# Altium schematic sheet Sheet1.SchDoc: LED_MATRIX
size A4; DocumentNumber: 1; Revision: 1.0; SheetNumber: 1; SheetTotal: 1
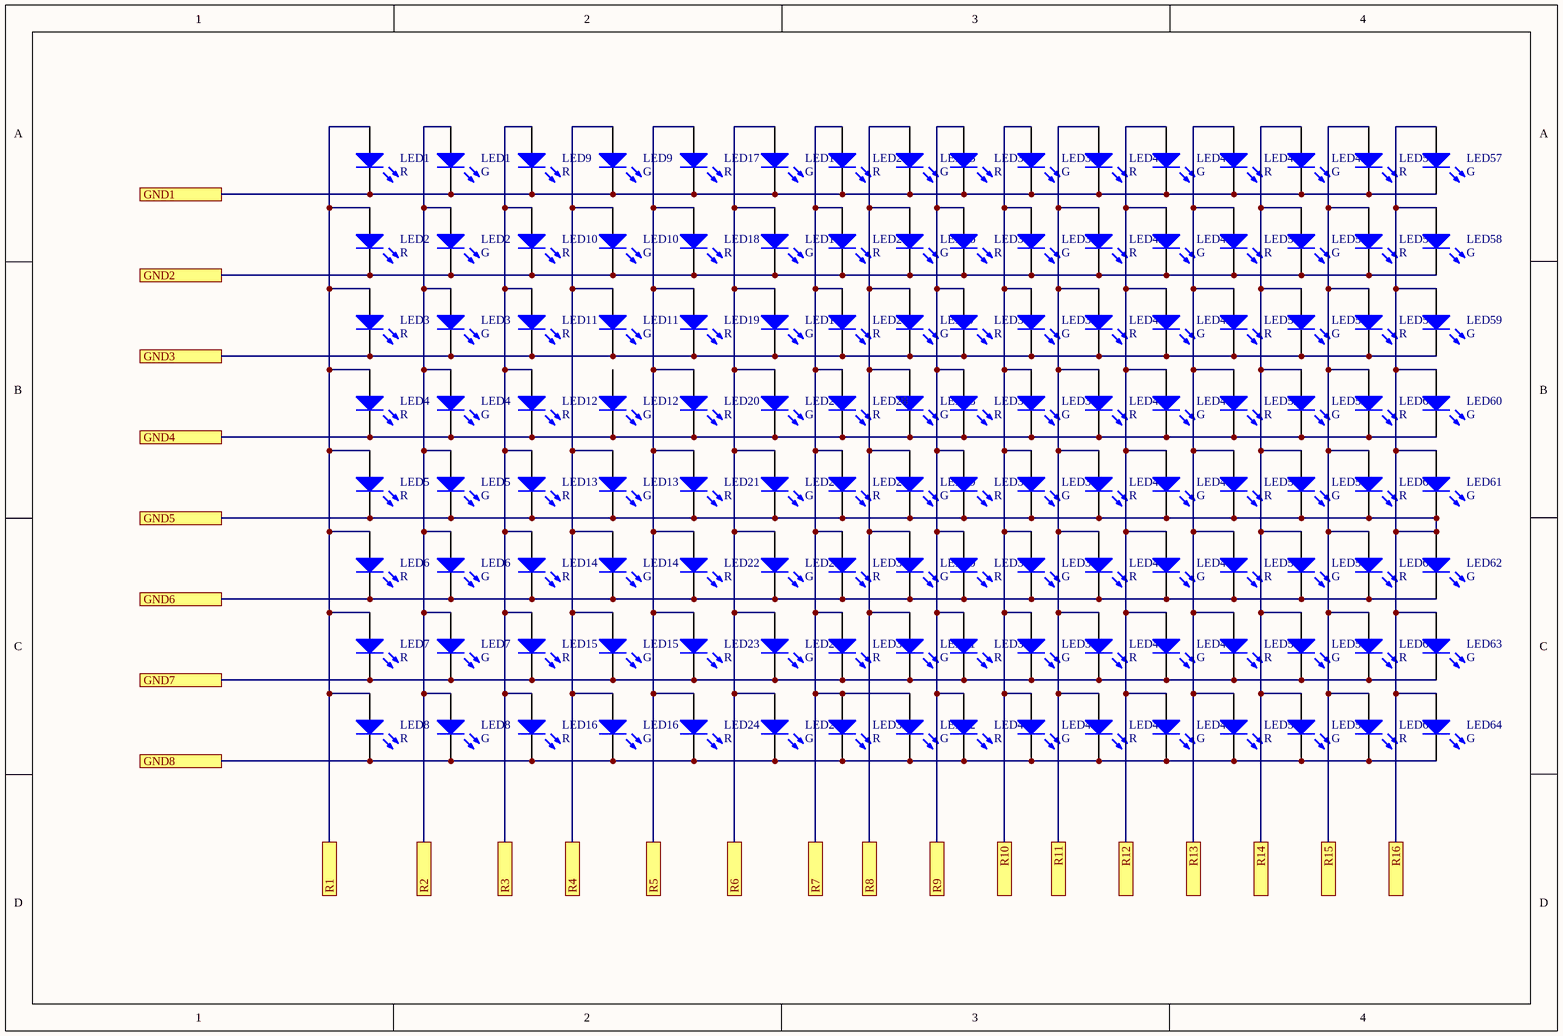
[diagram p0: Sheet1.SchDoc]

## Parts
(Parts that share a designator on the sheet are numbered #1, #2 ... from top to bottom, then left to right.)
LED1#1  R  [3.2X1.6X1.1]
LED1#2  G  [3.2X1.6X1.1]
LED2#1  R  [3.2X1.6X1.1]
LED2#2  G  [3.2X1.6X1.1]
LED3#1  R  [3.2X1.6X1.1]
LED3#2  G  [3.2X1.6X1.1]
LED4#1  R  [3.2X1.6X1.1]
LED4#2  G  [3.2X1.6X1.1]
LED5#1  R  [3.2X1.6X1.1]
LED5#2  G  [3.2X1.6X1.1]
LED6#1  R  [3.2X1.6X1.1]
LED6#2  G  [3.2X1.6X1.1]
LED7#1  R  [3.2X1.6X1.1]
LED7#2  G  [3.2X1.6X1.1]
LED8#1  R  [3.2X1.6X1.1]
LED8#2  G  [3.2X1.6X1.1]
LED9#1  R  [3.2X1.6X1.1]
LED9#2  G  [3.2X1.6X1.1]
LED10#1  R  [3.2X1.6X1.1]
LED10#2  G  [3.2X1.6X1.1]
LED11#1  R  [3.2X1.6X1.1]
LED11#2  G  [3.2X1.6X1.1]
LED12#1  R  [3.2X1.6X1.1]
LED12#2  G  [3.2X1.6X1.1]
LED13#1  R  [3.2X1.6X1.1]
LED13#2  G  [3.2X1.6X1.1]
LED14#1  R  [3.2X1.6X1.1]
LED14#2  G  [3.2X1.6X1.1]
LED15#1  R  [3.2X1.6X1.1]
LED15#2  G  [3.2X1.6X1.1]
LED16#1  R  [3.2X1.6X1.1]
LED16#2  G  [3.2X1.6X1.1]
LED17#1  R  [3.2X1.6X1.1]
LED17#2  G  [3.2X1.6X1.1]
LED18#1  R  [3.2X1.6X1.1]
LED18#2  G  [3.2X1.6X1.1]
LED19#1  R  [3.2X1.6X1.1]
LED19#2  G  [3.2X1.6X1.1]
LED20#1  R  [3.2X1.6X1.1]
LED20#2  G  [3.2X1.6X1.1]
LED21#1  R  [3.2X1.6X1.1]
LED21#2  G  [3.2X1.6X1.1]
LED22#1  R  [3.2X1.6X1.1]
LED22#2  G  [3.2X1.6X1.1]
LED23#1  R  [3.2X1.6X1.1]
LED23#2  G  [3.2X1.6X1.1]
LED24#1  R  [3.2X1.6X1.1]
LED24#2  G  [3.2X1.6X1.1]
LED25#1  R  [3.2X1.6X1.1]
LED25#2  G  [3.2X1.6X1.1]
LED26#1  R  [3.2X1.6X1.1]
LED26#2  G  [3.2X1.6X1.1]
LED27#1  R  [3.2X1.6X1.1]
LED27#2  G  [3.2X1.6X1.1]
LED28#1  R  [3.2X1.6X1.1]
LED28#2  G  [3.2X1.6X1.1]
LED29#1  R  [3.2X1.6X1.1]
LED29#2  G  [3.2X1.6X1.1]
LED30#1  R  [3.2X1.6X1.1]
LED30#2  G  [3.2X1.6X1.1]
LED31#1  R  [3.2X1.6X1.1]
LED31#2  G  [3.2X1.6X1.1]
LED32#1  R  [3.2X1.6X1.1]
LED32#2  G  [3.2X1.6X1.1]
LED33#1  R  [3.2X1.6X1.1]
LED33#2  G  [3.2X1.6X1.1]
LED34#1  R  [3.2X1.6X1.1]
LED34#2  G  [3.2X1.6X1.1]
LED35#1  R  [3.2X1.6X1.1]
LED35#2  G  [3.2X1.6X1.1]
LED36#1  R  [3.2X1.6X1.1]
LED36#2  G  [3.2X1.6X1.1]
LED37#1  R  [3.2X1.6X1.1]
LED37#2  G  [3.2X1.6X1.1]
LED38#1  R  [3.2X1.6X1.1]
LED38#2  G  [3.2X1.6X1.1]
LED39#1  R  [3.2X1.6X1.1]
LED39#2  G  [3.2X1.6X1.1]
LED40#1  R  [3.2X1.6X1.1]
LED40#2  G  [3.2X1.6X1.1]
LED41#1  R  [3.2X1.6X1.1]
LED41#2  G  [3.2X1.6X1.1]
LED42#1  R  [3.2X1.6X1.1]
LED42#2  G  [3.2X1.6X1.1]
LED43#1  R  [3.2X1.6X1.1]
LED43#2  G  [3.2X1.6X1.1]
LED44#1  R  [3.2X1.6X1.1]
LED44#2  G  [3.2X1.6X1.1]
LED45#1  R  [3.2X1.6X1.1]
LED45#2  G  [3.2X1.6X1.1]
LED46#1  R  [3.2X1.6X1.1]
LED46#2  G  [3.2X1.6X1.1]
LED47#1  R  [3.2X1.6X1.1]
LED47#2  G  [3.2X1.6X1.1]
LED48#1  R  [3.2X1.6X1.1]
LED48#2  G  [3.2X1.6X1.1]
LED49#1  R  [3.2X1.6X1.1]
LED49#2  G  [3.2X1.6X1.1]
LED50#1  R  [3.2X1.6X1.1]
LED50#2  G  [3.2X1.6X1.1]
LED51#1  R  [3.2X1.6X1.1]
LED51#2  G  [3.2X1.6X1.1]
LED52#1  R  [3.2X1.6X1.1]
LED52#2  G  [3.2X1.6X1.1]
LED53#1  R  [3.2X1.6X1.1]
LED53#2  G  [3.2X1.6X1.1]
LED54#1  R  [3.2X1.6X1.1]
LED54#2  G  [3.2X1.6X1.1]
LED55#1  R  [3.2X1.6X1.1]
LED55#2  G  [3.2X1.6X1.1]
LED56#1  R  [3.2X1.6X1.1]
LED56#2  G  [3.2X1.6X1.1]
LED57#1  R  [3.2X1.6X1.1]
LED57#2  G  [3.2X1.6X1.1]
LED58#1  R  [3.2X1.6X1.1]
LED58#2  G  [3.2X1.6X1.1]
LED59#1  R  [3.2X1.6X1.1]
LED59#2  G  [3.2X1.6X1.1]
LED60#1  R  [3.2X1.6X1.1]
LED60#2  G  [3.2X1.6X1.1]
LED61#1  R  [3.2X1.6X1.1]
LED61#2  G  [3.2X1.6X1.1]
LED62#1  R  [3.2X1.6X1.1]
LED62#2  G  [3.2X1.6X1.1]
LED63#1  R  [3.2X1.6X1.1]
LED63#2  G  [3.2X1.6X1.1]
LED64#1  R  [3.2X1.6X1.1]
LED64#2  G  [3.2X1.6X1.1]

## Ports
GND1, GND2, GND3, GND4, GND5, GND6, GND7, GND8, R1, R2, R3, R4, R5, R6, R7, R8, R9, R10, R11, R12, R13, R14, R15, R16

## Nets
GND1: LED1#1.2(K) LED1#2.2(K) LED9#1.2(K) LED9#2.2(K) LED17#1.2(K) LED17#2.2(K) LED25#1.2(K) LED25#2.2(K) LED33#1.2(K) LED33#2.2(K) LED41#1.2(K) LED41#2.2(K) LED49#1.2(K) LED49#2.2(K) LED57#1.2(K) LED57#2.2(K) ; port GND1
GND2: LED2#1.2(K) LED2#2.2(K) LED10#1.2(K) LED10#2.2(K) LED18#1.2(K) LED18#2.2(K) LED26#1.2(K) LED26#2.2(K) LED34#1.2(K) LED34#2.2(K) LED42#1.2(K) LED42#2.2(K) LED50#1.2(K) LED50#2.2(K) LED58#1.2(K) LED58#2.2(K) ; port GND2
GND3: LED3#1.2(K) LED3#2.2(K) LED11#1.2(K) LED11#2.2(K) LED19#1.2(K) LED19#2.2(K) LED27#1.2(K) LED27#2.2(K) LED35#1.2(K) LED35#2.2(K) LED43#1.2(K) LED43#2.2(K) LED51#1.2(K) LED51#2.2(K) LED59#1.2(K) LED59#2.2(K) ; port GND3
GND4: LED4#1.2(K) LED4#2.2(K) LED12#1.2(K) LED12#2.2(K) LED20#1.2(K) LED20#2.2(K) LED28#1.2(K) LED28#2.2(K) LED36#1.2(K) LED36#2.2(K) LED44#1.2(K) LED44#2.2(K) LED52#1.2(K) LED52#2.2(K) LED60#1.2(K) LED60#2.2(K) ; port GND4
GND5: LED5#1.2(K) LED5#2.2(K) LED13#1.2(K) LED13#2.2(K) LED21#1.2(K) LED21#2.2(K) LED29#1.2(K) LED29#2.2(K) LED37#1.2(K) LED37#2.2(K) LED45#1.2(K) LED45#2.2(K) LED53#1.2(K) LED53#2.2(K) LED57#2.1(A) LED58#2.1(A) LED59#2.1(A) LED60#2.1(A) LED61#1.2(K) LED61#2.1(A) LED61#2.2(K) LED62#2.1(A) LED63#2.1(A) LED64#2.1(A) ; port GND5, port R16
GND6: LED6#1.2(K) LED6#2.2(K) LED14#1.2(K) LED14#2.2(K) LED22#1.2(K) LED22#2.2(K) LED30#1.2(K) LED30#2.2(K) LED38#1.2(K) LED38#2.2(K) LED46#1.2(K) LED46#2.2(K) LED54#1.2(K) LED54#2.2(K) LED62#1.2(K) LED62#2.2(K) ; port GND6
GND7: LED7#1.2(K) LED7#2.2(K) LED15#1.2(K) LED15#2.2(K) LED23#1.2(K) LED23#2.2(K) LED31#1.2(K) LED31#2.2(K) LED39#1.2(K) LED39#2.2(K) LED47#1.2(K) LED47#2.2(K) LED55#1.2(K) LED55#2.2(K) LED63#1.2(K) LED63#2.2(K) ; port GND7
GND8: LED8#1.2(K) LED8#2.2(K) LED16#1.2(K) LED16#2.2(K) LED24#1.2(K) LED24#2.2(K) LED32#1.2(K) LED32#2.2(K) LED40#1.2(K) LED40#2.2(K) LED48#1.2(K) LED48#2.2(K) LED56#1.2(K) LED56#2.2(K) LED64#1.2(K) LED64#2.2(K) ; port GND8
R1: LED1#1.1(A) LED2#1.1(A) LED3#1.1(A) LED4#1.1(A) LED5#1.1(A) LED6#1.1(A) LED7#1.1(A) LED8#1.1(A) ; port R1
R2: LED1#2.1(A) LED2#2.1(A) LED3#2.1(A) LED4#2.1(A) LED5#2.1(A) LED6#2.1(A) LED7#2.1(A) LED8#2.1(A) ; port R2
R3: LED9#1.1(A) LED10#1.1(A) LED11#1.1(A) LED12#1.1(A) LED13#1.1(A) LED14#1.1(A) LED15#1.1(A) LED16#1.1(A) ; port R3
R4: LED9#2.1(A) LED10#2.1(A) LED11#2.1(A) LED13#2.1(A) LED14#2.1(A) LED15#2.1(A) LED16#2.1(A) ; port R4
R5: LED17#1.1(A) LED18#1.1(A) LED19#1.1(A) LED20#1.1(A) LED21#1.1(A) LED22#1.1(A) LED23#1.1(A) LED24#1.1(A) ; port R5
R6: LED17#2.1(A) LED18#2.1(A) LED19#2.1(A) LED20#2.1(A) LED21#2.1(A) LED22#2.1(A) LED23#2.1(A) LED24#2.1(A) ; port R6
R7: LED25#1.1(A) LED26#1.1(A) LED27#1.1(A) LED28#1.1(A) LED29#1.1(A) LED30#1.1(A) LED31#1.1(A) LED32#1.1(A) LED32#2.1(A) ; port R7
R8: LED25#2.1(A) LED26#2.1(A) LED27#2.1(A) LED28#2.1(A) LED29#2.1(A) LED30#2.1(A) LED31#2.1(A) ; port R8
R9: LED33#1.1(A) LED34#1.1(A) LED35#1.1(A) LED36#1.1(A) LED37#1.1(A) LED38#1.1(A) LED39#1.1(A) LED40#1.1(A) ; port R9
R10: LED33#2.1(A) LED34#2.1(A) LED35#2.1(A) LED36#2.1(A) LED37#2.1(A) LED38#2.1(A) LED39#2.1(A) LED40#2.1(A) ; port R10
R11: LED41#1.1(A) LED42#1.1(A) LED43#1.1(A) LED44#1.1(A) LED45#1.1(A) LED46#1.1(A) LED47#1.1(A) LED48#1.1(A) ; port R11
R12: LED41#2.1(A) LED42#2.1(A) LED43#2.1(A) LED44#2.1(A) LED45#2.1(A) LED46#2.1(A) LED47#2.1(A) LED48#2.1(A) ; port R12
R13: LED49#1.1(A) LED50#1.1(A) LED51#1.1(A) LED52#1.1(A) LED53#1.1(A) LED54#1.1(A) LED55#1.1(A) LED56#1.1(A) ; port R13
R14: LED49#2.1(A) LED50#2.1(A) LED51#2.1(A) LED52#2.1(A) LED53#2.1(A) LED54#2.1(A) LED55#2.1(A) LED56#2.1(A) ; port R14
R15: LED57#1.1(A) LED58#1.1(A) LED59#1.1(A) LED60#1.1(A) LED61#1.1(A) LED62#1.1(A) LED63#1.1(A) LED64#1.1(A) ; port R15

Not connected (* = marked no-connect by the designer): LED12#2 1(A)

## Library data of the parts
LED1#1 LED1#2 LED2#1 LED2#2 LED3#1 LED3#2 LED4#1 LED4#2 LED5#1 LED5#2 LED6#1 LED6#2 LED7#1 LED7#2 LED8#1 LED8#2 LED9#1 LED9#2 LED10#1 LED10#2 LED11#1 LED11#2 LED12#1 LED12#2 LED13#1 LED13#2 LED14#1 LED14#2 LED15#1 LED15#2 LED16#1 LED16#2 LED17#1 LED17#2 LED18#1 LED18#2 LED19#1 LED19#2 LED20#1 LED20#2 LED21#1 LED21#2 LED22#1 LED22#2 LED23#1 LED23#2 LED24#1 LED24#2 LED25#1 LED25#2 LED26#1 LED26#2 LED27#1 LED27#2 LED28#1 LED28#2 LED29#1 LED29#2 LED30#1 LED30#2 LED31#1 LED31#2 LED32#1 LED32#2 LED33#1 LED33#2 LED34#1 LED34#2 LED35#1 LED35#2 LED36#1 LED36#2 LED37#1 LED37#2 LED38#1 LED38#2 LED39#1 LED39#2 LED40#1 LED40#2 LED41#1 LED41#2 LED42#1 LED42#2 LED43#1 LED43#2 LED44#1 LED44#2 LED45#1 LED45#2 LED46#1 LED46#2 LED47#1 LED47#2 LED48#1 LED48#2 LED49#1 LED49#2 LED50#1 LED50#2 LED51#1 LED51#2 LED52#1 LED52#2 LED53#1 LED53#2 LED54#1 LED54#2 LED55#1 LED55#2 LED56#1 LED56#2 LED57#1 LED57#2 LED58#1 LED58#2 LED59#1 LED59#2 LED60#1 LED60#2 LED61#1 LED61#2 LED62#1 LED62#2 LED63#1 LED63#2 LED64#1 LED64#2 = LED2: Typical RED, GREEN, YELLOW, AMBER GaAs LED; Published: 8-Jun-2000; LatestRevisionDate: 17-Jul-2002; LatestRevisionNote: Re-released for DXP Platform.; PackageVersion: Feb-2002; PackageReference: 3.2X1.6X1.1; Publisher: Altium Limited; PackageDescription: SM LED; 2 Flat Leads